# EAGLE schematic FSG_2019_BSPD_0.2_traversant (EAGLE 9.2.1)
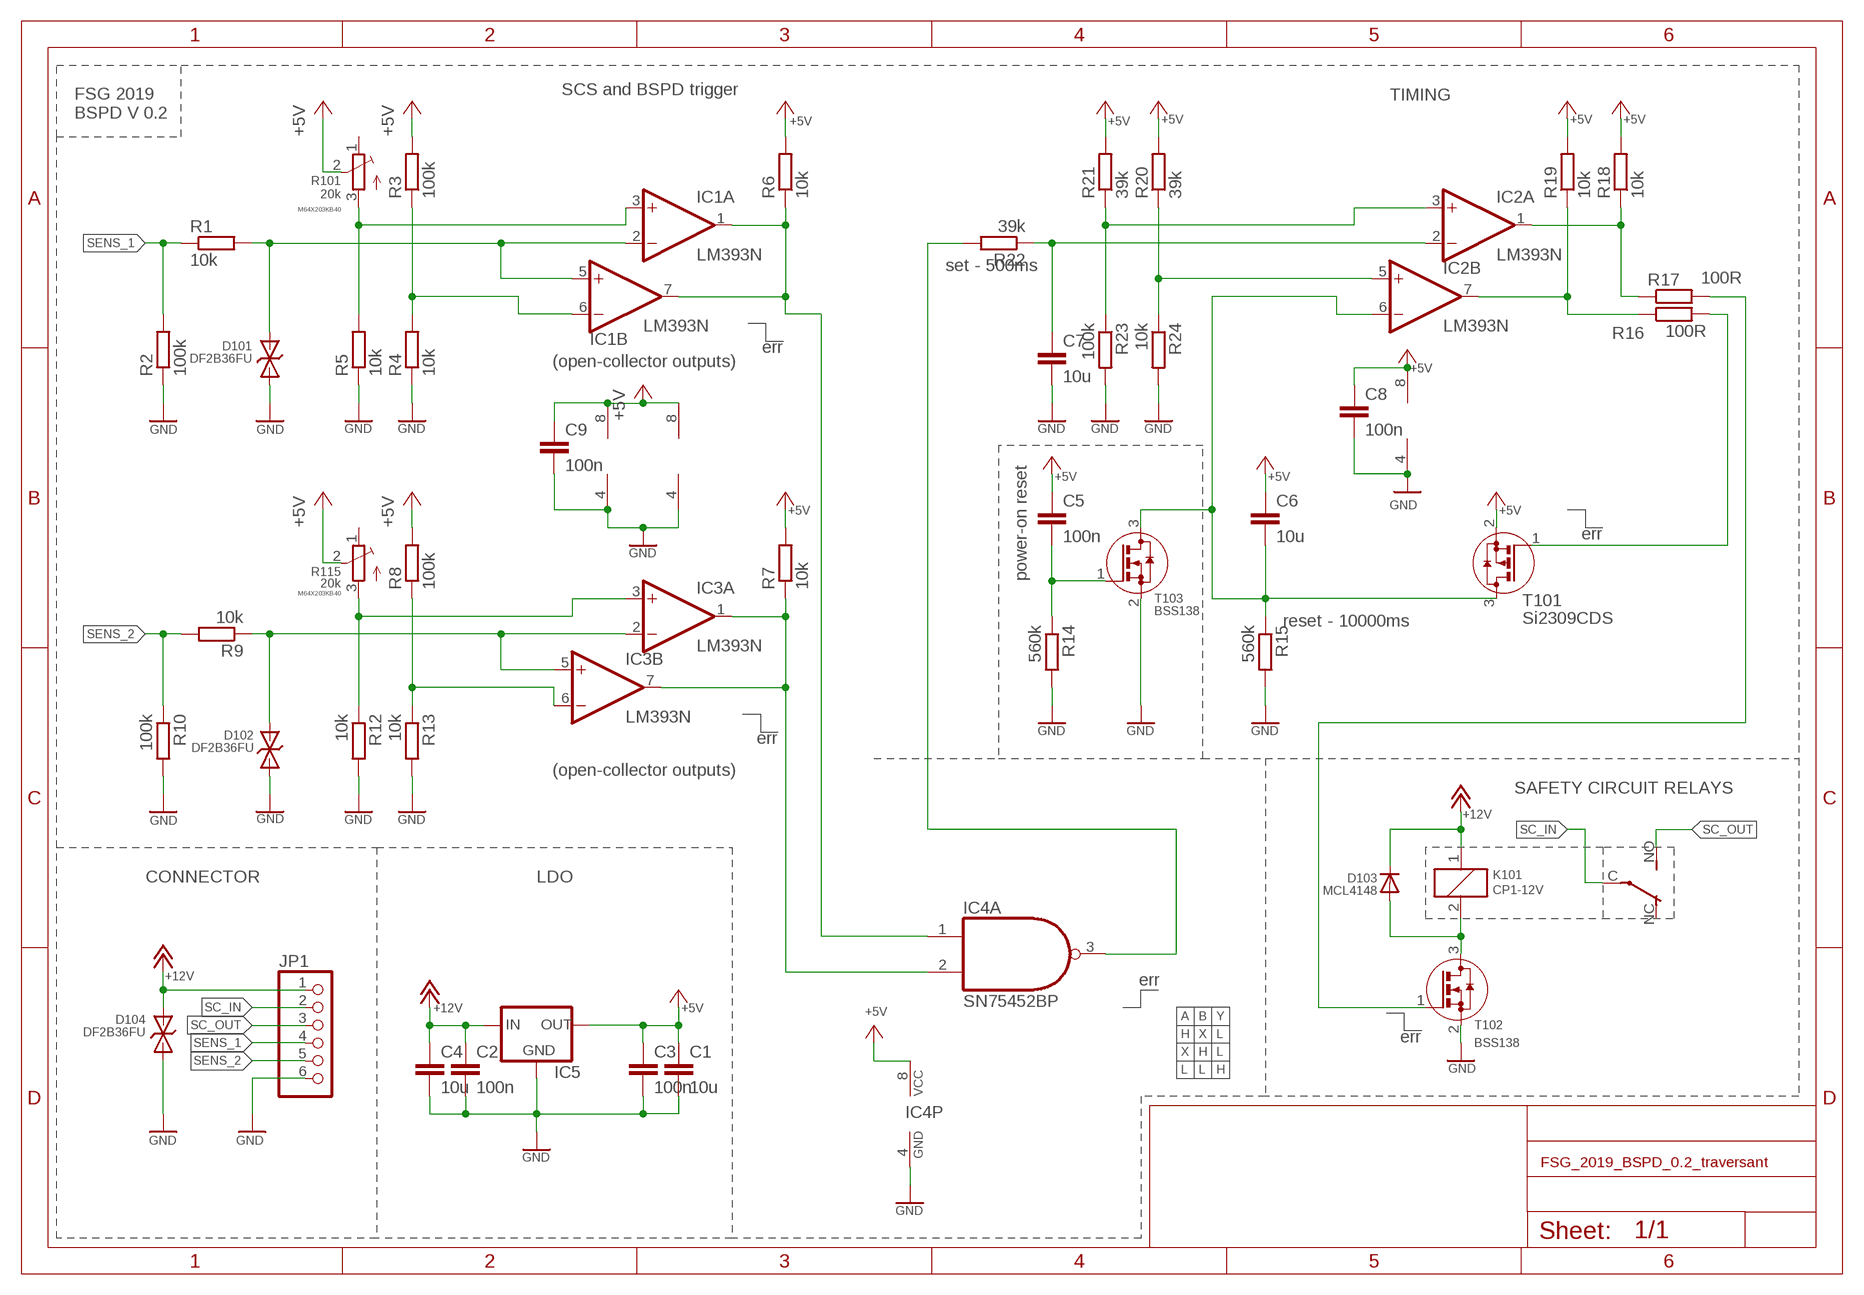
[diagram p0: schematic, sheet 1]

## Parts
C1  10u  C-EU075-052X106  [C075-052X106]
C2  100n  C-EU025-024X044  [C025-024X044]
C3  100n  C-EU025-024X044  [C025-024X044]
C4  10u  C-EU075-052X106  [C075-052X106]
C5  100n  C-EU025-024X044  [C025-024X044]
C6  10u  C-EU075-052X106  [C075-052X106]
C7  10u  C-EU075-052X106  [C075-052X106]
C8  100n  C-EU025-024X044  [C025-024X044]
C9  100n  C-EU025-024X044  [C025-024X044]
D101  DF2B36FU  [SOD323]
D102  DF2B36FU  [SOD323]
D103  MCL4148  D.MCL4148  [MICROMELF]
D104  DF2B36FU  [SOD323]
IC1  LM393N  [DIL08]
IC2  LM393N  [DIL08]
IC3  LM393N  [DIL08]
IC4  SN75452BP  [DIL08]
IC5  LM1117V  [78XXS]
JP1  PINHD-1X6  [1X06]
K101  CP1-12V  [CP1]
R1  10k  R-EU_0204/7  [0204/7]
R2  100k  R-EU_0204/7  [0204/7]
R3  100k  R-EU_0204/7  [0204/7]
R4  10k  R-EU_0204/7  [0204/7]
R5  10k  R-EU_0204/7  [0204/7]
R6  10k  R-EU_0204/7  [0204/7]
R7  10k  R-EU_0204/7  [0204/7]
R8  100k  R-EU_0204/7  [0204/7]
R9  10k  R-EU_0204/7  [0204/7]
R10  100k  R-EU_0204/7  [0204/7]
R12  10k  R-EU_0204/7  [0204/7]
R13  10k  R-EU_0204/7  [0204/7]
R14  560k  R-EU_0204/7  [0204/7]
R15  560k  R-EU_0204/7  [0204/7]
R16  100R  R-EU_0204/7  [0204/7]
R17  100R  R-EU_0204/7  [0204/7]
R18  10k  R-EU_0204/7  [0204/7]
R19  10k  R-EU_0204/7  [0204/7]
R20  39k  R-EU_0204/7  [0204/7]
R21  39k  R-EU_0204/7  [0204/7]
R22  39k  R-EU_0204/7  [0204/7]
R23  100k  R-EU_0204/7  [0204/7]
R24  10k  R-EU_0204/7  [0204/7]
R101  20k  POTI.M64X201KB40  [M64X201KB40]
R115  20k  POTI.M64X201KB40  [M64X201KB40]
T101  Si2309CDS  P-MOSFET.SOT23  [SOT-23]
T102  BSS138  N-MOSFET.SOT23  [SOT-23]
T103  BSS138  N-MOSFET.SOT23  [SOT-23]

## Nets
+5V: C1.1 C3.1 C5.1 C6.1 C8.1 C9.1 IC1.8(P:V+) IC2.8(P:V+) IC3.8(P:V+) IC4.8(P:VCC) IC5.OUT R3.2 R6.2 R7.2 R8.2 R18.2 R19.2 R20.2 R21.2 R101.2(M) R115.2(M) T101.2(S)
+12V: C2.1 C4.1 D103.C D104.2(C) IC5.IN JP1.1 K101.1
BRAKE_F: D101.2(C) IC1.2(A:-IN) IC1.5(B:+IN) R1.2
DF: D102.2(C) IC3.2(A:-IN) IC3.5(B:+IN) R9.1
GND: C1.2 C2.2 C3.2 C4.2 C7.2 C8.2 C9.2 D101.1(A) D102.1(A) D104.1(A) IC1.4(P:V-) IC2.4(P:V-) IC3.4(P:V-) IC4.4(P:GND) IC5.GND JP1.6 R2.1 R4.1 R5.1 R10.2 R12.2 R13.2 R14.2 R15.2 R23.2 R24.2 T102.2(S) T103.2(S)
N$1: IC2.5(B:+IN) R20.1 R24.1
N$2: IC3.1(A:OUT) IC3.7(B:OUT) IC4.2(A:I1) R7.1
N$3: IC4.3(A:O) R22.2
N$4: IC2.7(B:OUT) R16.1 R19.1
N$5: C5.2 R14.1 T103.1(G)
N$6: IC1.3(A:+IN) R5.2 R101.3(A)
N$7: C6.2 IC2.6(B:-IN) R15.1 T101.3(D) T103.3(D)
N$9: IC1.1(A:OUT) IC1.7(B:OUT) IC4.1(A:I0) R6.1
N$10: R17.2 T102.1(G)
N$11: D103.A K101.2 T102.3(D)
N$12: IC3.3(A:+IN) R12.1 R115.3(A)
N$13: IC2.3(A:+IN) R21.1 R23.1
N$14: IC1.6(B:-IN) R3.1 R4.2
N$15: IC2.1(A:OUT) R17.1 R18.1
N$16: IC3.6(B:-IN) R8.1 R13.1
N$17: C7.1 IC2.2(A:-IN) R22.1
N$20: R16.2 T101.1(G)
SC_IN: JP1.2 K101.C(2:P)
SC_OUT: JP1.3 K101.NO(2:S)
SENS_1: JP1.4 R1.1 R2.2
SENS_2: JP1.5 R9.2 R10.1
Unconnected: IC4.5(B:O) IC4.6(B:I1) IC4.7(B:I0) K101.NC(2:O) R101.1(E) R115.1(E)

## Notes on the sheet
- SCS and BSPD trigger
- TIMING
- FSG 2019
  BSPD V 0.2
- M64X203KB40
- set - 500ms
- err
- (open-collector outputs)
- err
- power-on reset
- M64X203KB40
- reset - 10000ms
- err
- (open-collector outputs)
- SAFETY CIRCUIT RELAYS
- CONNECTOR | LDO
- err
- A | B | Y
- H | X | L
- err
- X | H | L
- L | L | H

## Library data of the parts
C1-C9 = rcl:C-EU: CAPACITOR, European symbol; SPICEPREFIX: C
D101 D102 D104 = diode:DF2B36FU
D103 = MCS-Dioden:D; HEIGHT: 1.2
IC1-IC3 = linear:LM393: COMPARATOR
IC4 = texas-sn55-sn75:SN75452B: NAND PERIPHERAL DRIVERS FOR HIGH-CURRENT SWITCHING AT VERY HIGH SPEEDS Source: www.ti.com sn75452b.pdf
IC5 = v-reg-3:LM1117
JP1 = pinhead:PINHD-1X6: PIN HEADER
K101 = relay:CP1?-*: ULTRA-MINIATURE LOW PROFILE AUTOMOTIVE RELAY NAiS Source: http://www.mew-europe.com/.. en_ds_61207_0000.pdf; MF: AROMAT/ MATSUSHITA; MPN: CP1-12V; OC_FARNELL: unknown; OC_NEWARK: 10C5508
R1-R10 R12-R24 = resistor:R-EU_: RESISTOR, European symbol
R101 R115 = MCS-rcl:POTI
T101 = MCS-Transistoren:P-MOSFET; HEIGHT: 1.2
T102 T103 = MCS-Transistoren:N-MOSFET; HEIGHT: 1.2